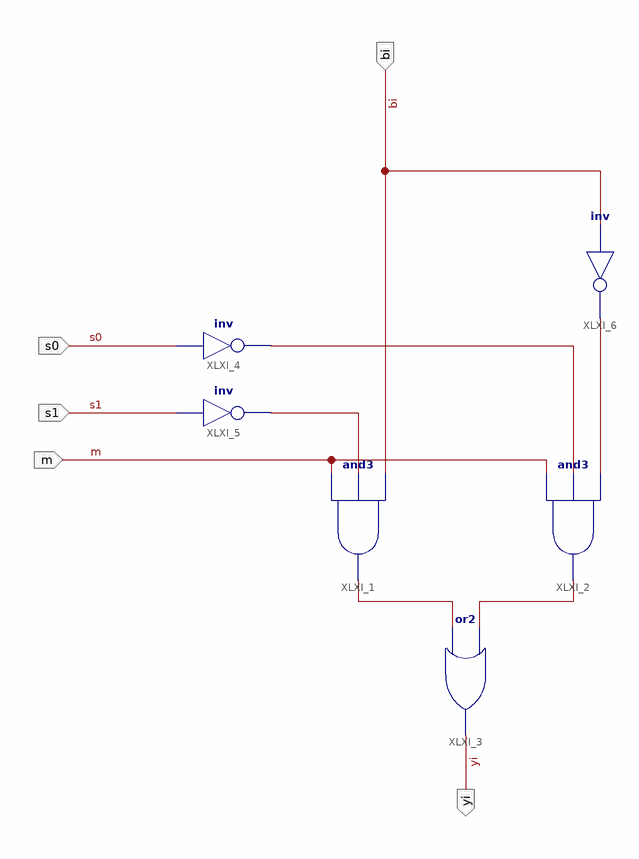
[diagram p0: schematic sheet 1]
// Xilinx ISE schematic arith_ext.sch (artix7) as structural Verilog: 6 symbols, 5 ports
module arith_ext (
  input  s1,
  input  m,
  input  bi,
  input  s0,
  output yi
);

  wire XLXN_1, XLXN_2, XLXN_3, XLXN_7, XLXN_10;

  and XLXI_1 (XLXN_2, m, XLXN_3, bi);
  and XLXI_2 (XLXN_1, m, XLXN_10, XLXN_7);
  or XLXI_3 (yi, XLXN_2, XLXN_1);
  not XLXI_4 (XLXN_10, s0);
  not XLXI_5 (XLXN_3, s1);
  not XLXI_6 (XLXN_7, bi);
endmodule
